# EAGLE design pH (EAGLE 9.6.2)
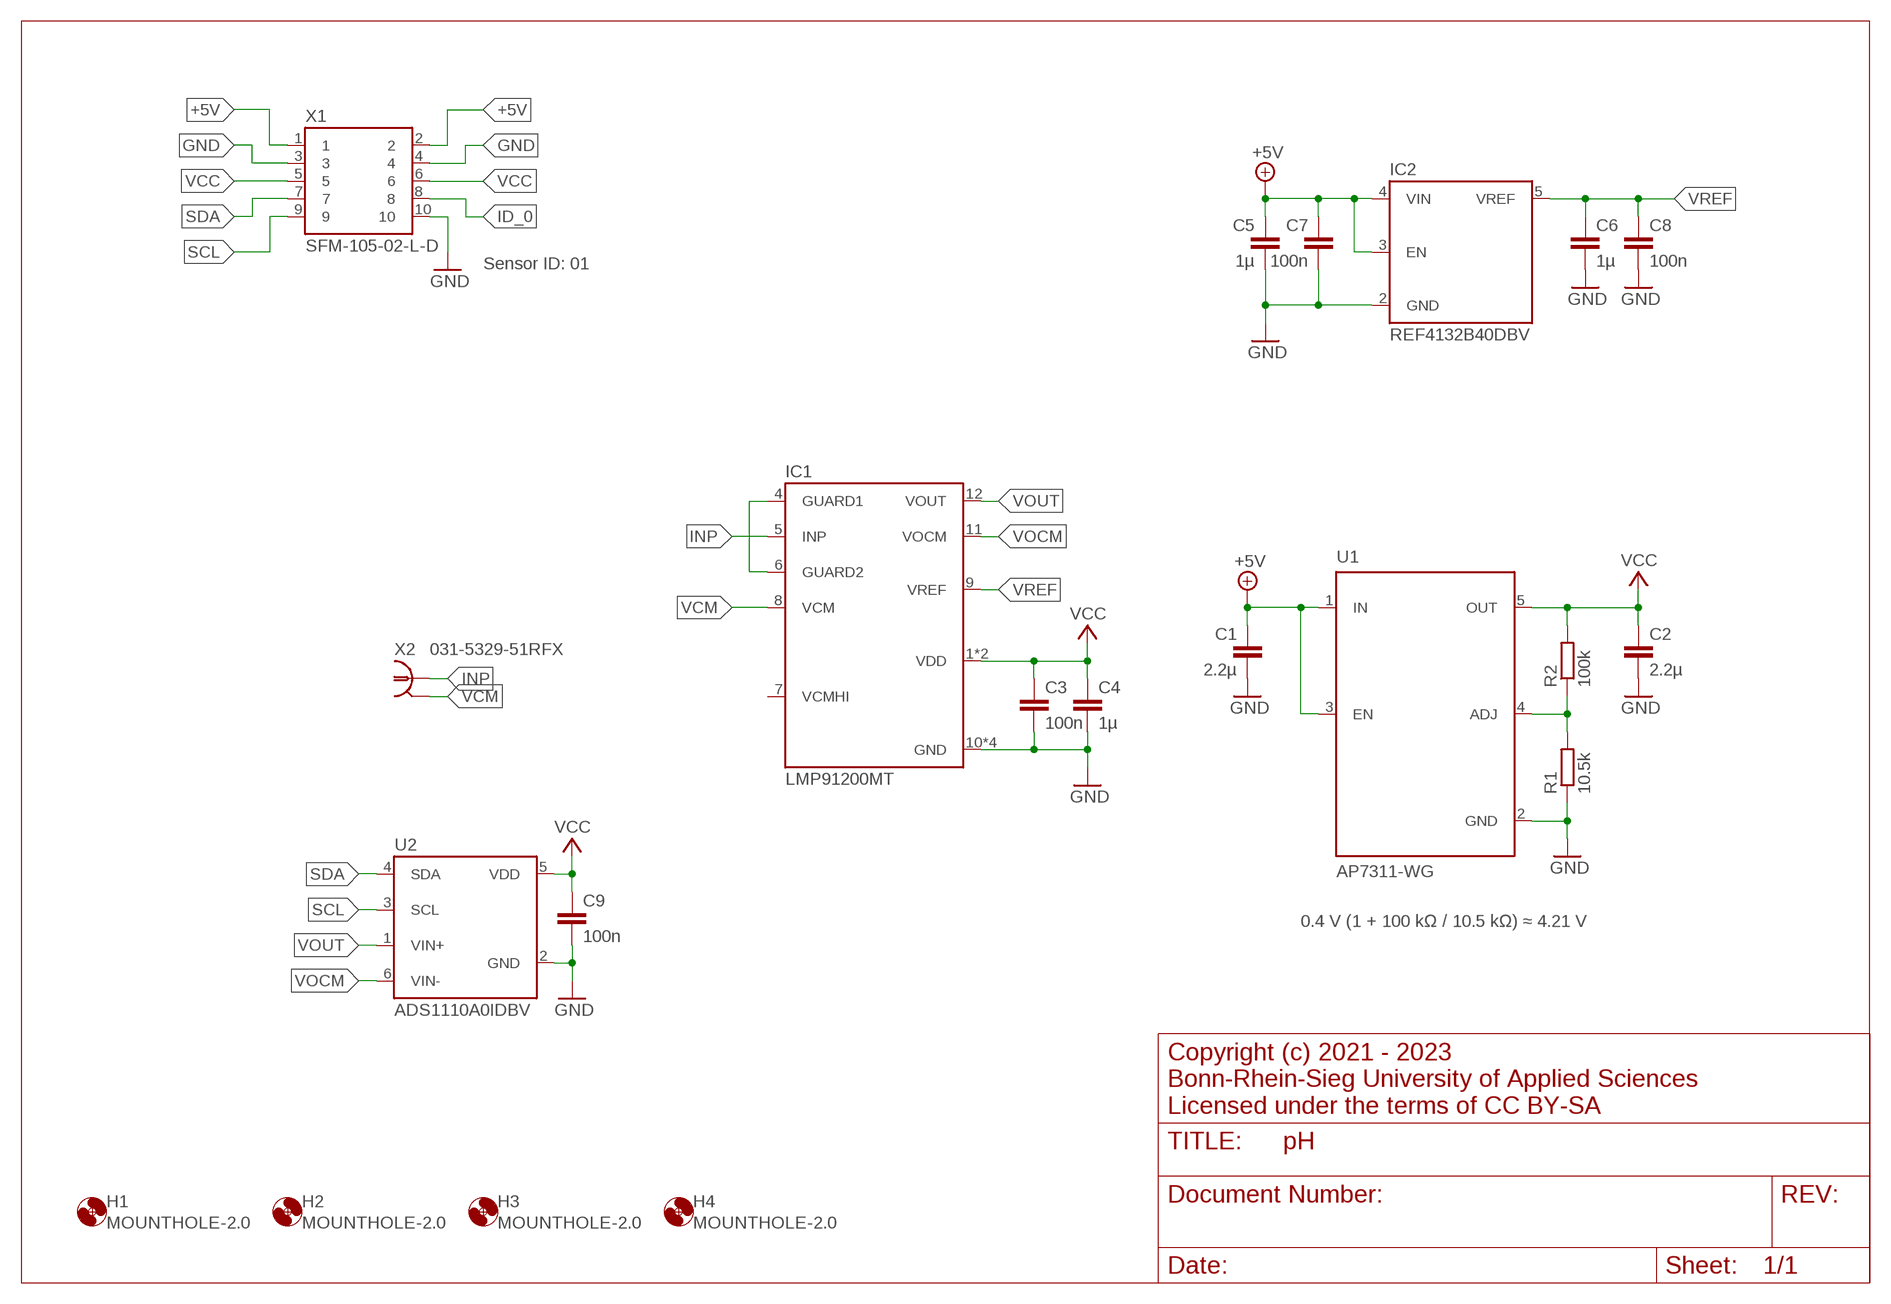
[diagram p0: schematic, sheet 1]

## Parts
C1  2.2µ  C-EUC0603  [C0603]
C2  2.2µ  C-EUC0603  [C0603]
C3  100n  C-EUC0603  [C0603]
C4  1µ  C-EUC0603  [C0603]
C5  1µ  C-EUC0603  [C0603]
C6  1µ  C-EUC0603  [C0603]
C7  100n  C-EUC0603  [C0603]
C8  100n  C-EUC0603  [C0603]
C9  100n  C-EUC0603  [C0603]
H1  MOUNTHOLE-2.0  [2.0]
H2  MOUNTHOLE-2.0  [2.0]
H3  MOUNTHOLE-2.0  [2.0]
H4  MOUNTHOLE-2.0  [2.0]
IC1  LMP91200MT  [TSSOP16]
IC2  REF4132B40DBV  [SOT23-5]
R1  10.5k  R-EU_R0603  [R0603]
R2  100k  R-EU_R0603  [R0603]
U1  AP7311-WG  [SOT-23]
U2  ADS1110A0IDBV  [SOT23-6]
X1  SFM-105-02-L-D  [SAMTEC-SFM-105-02-L-D]
X2  031-5329-51RFX  [031-5329-51RFX]

## Nets
+5V: C1.1 C5.1 C7.1 IC2.3(EN) IC2.4(VIN) U1.1(IN) U1.3(EN) X1.1 X1.2
GND: C1.2 C2.2 C3.2 C4.2 C5.2 C6.2 C7.2 C8.2 C9.2 IC1.10(GND) IC1.13(GND) IC1.15(GND) IC1.16(GND) IC2.2(GND) R1.1 U1.2(GND) U2.2(GND) X1.3 X1.4 X1.10
ID_0: X1.8
INP: IC1.5(INP) X2.1
N$1: IC1.4(GUARD1) IC1.6(GUARD2)
N$2: R1.2 R2.1 U1.4(ADJ)
SCL: U2.3(SCL) X1.9
SDA: U2.4(SDA) X1.7
VCC: C2.1 C3.1 C4.1 C9.1 IC1.1(VDD) IC1.14(VDD) R2.2 U1.5(OUT) U2.5(VDD) X1.5 X1.6
VCM: IC1.8(VCM) X2.2 X2.3 X2.4 X2.5
VOCM: IC1.11(VOCM) U2.6(VIN-)
VOUT: IC1.12(VOUT) U2.1(VIN+)
VREF: C6.1 C8.1 IC1.9(VREF) IC2.5(VREF)
Unconnected: IC1.7(VCMHI)

## Notes on the sheet
- Sensor ID: 01
- 0.4 V (1 + 100 kΩ / 10.5 kΩ) ≈ 4.21 V
- Copyright (c) 2021 - 2023
  Bonn-Rhein-Sieg University of Applied Sciences
  Licensed under the terms of CC BY-SA

## Library data of the parts
C1-C9 = rcl:C-EU: CAPACITOR, European symbol
H1-H4 = MountHoles:MOUNTHOLE-2.0
IC1 = LMP91200:LMP91200: Configurable AFE for Low-Power Chemical-Sensing Applications
IC2 = REF4132:REF4132: Low-Drift, Low-Power, Small-Footprint Series Voltage Reference
R1 R2 = rcl:R-EU_: RESISTOR, European symbol
U1 = AP7311:AP7311-?*: 150mA, Low Quiescent Current, Fast Transient, Low Dropout Linear Regulator
U2 = ADS1110:ADS1110*I?: 16-Bit ANALOG-TO-DIGITAL CONVERTER with Onboard Reference
X1 = SFM-10x-02-L-D:SFM-105-02-L-D
X2 = BNC:031-5329-51RFX: BNC CONNECTOR

## Board
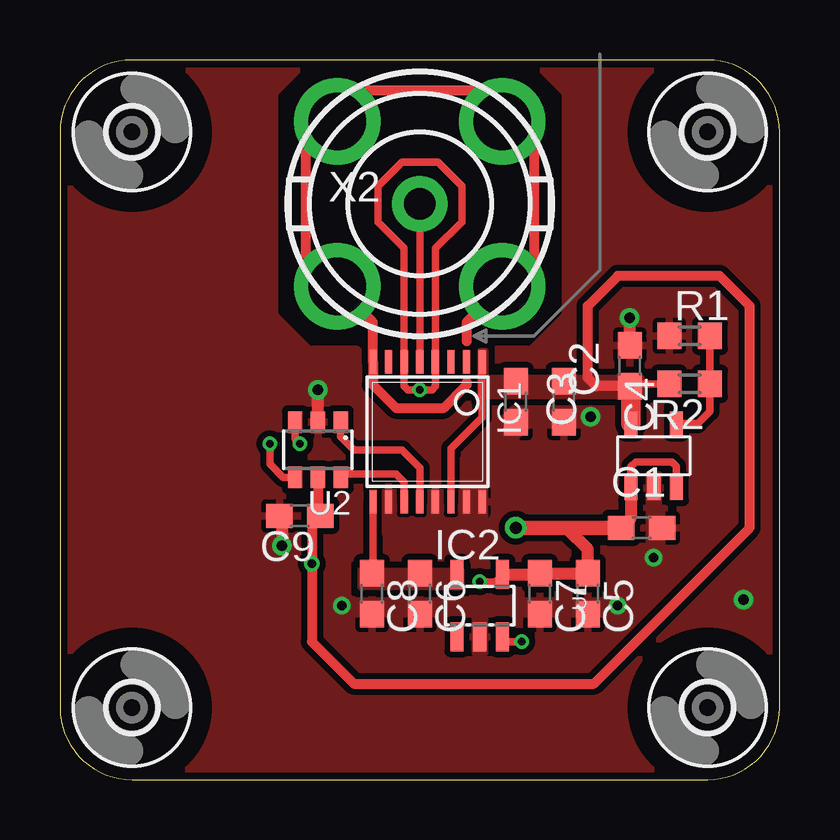
[diagram p1: board, top side]
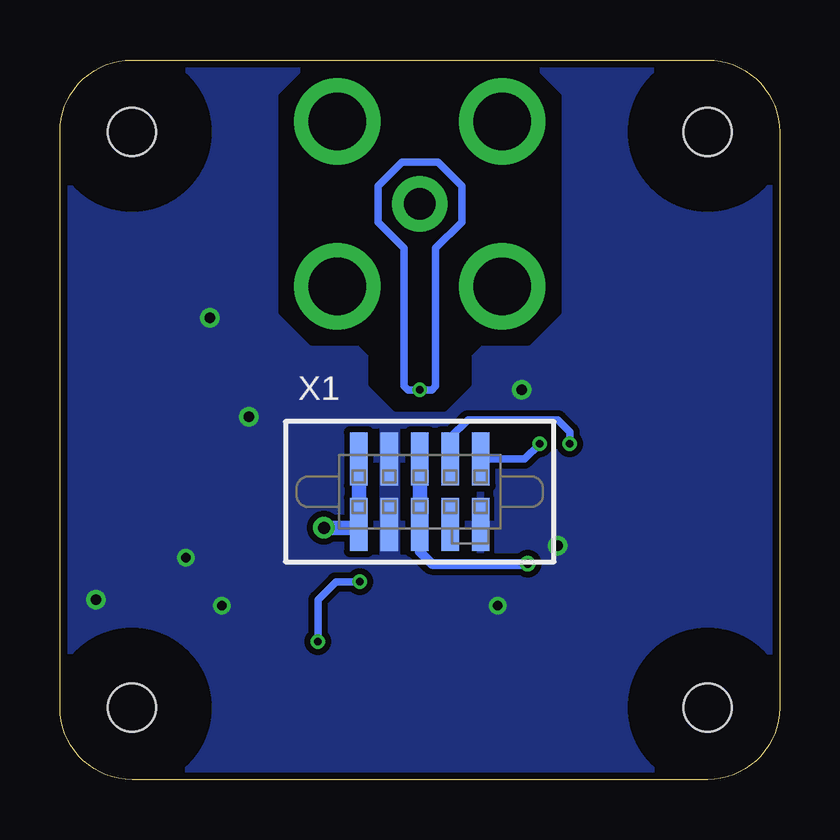
[diagram p2: board, bottom side, seen from below]

Size 30 x 30 mm. Coordinates in mm from the lower left corner, seen from the top.
Outline: 3,0 27,0 arc90 30,3 30,27 arc90 27,30 3,30 arc90 0,27 0,3 arc90 3,0
Copper layers (1*16): Top 0.035mm / dielectric 1.5mm / Bottom 0.035mm
Design rules "PCB-POOL Standard": minimum track width 0.15mm, minimum drill 0.3mm, track to track 0.15mm, track to pad 0.15mm, pad to pad 0.15mm, via to via 0.15mm, smd to smd 0.15mm, copper to edge 0.3mm, drill to drill 0.2mm, minimum pad ring 0.2mm, minimum via ring 0.15mm, stop-mask expansion 0.075mm, vias tented up to drill 0mil, thermal gap 0.2mm

### Footprints (pad centres in the part's own frame; a part is rotated, then mirrored left to right if it is on the bottom)
C0603 = smd 1.1 x 1: 1 -0.85,0; 2 0.85,0
2.0 = hole 2: 0,0
TSSOP16 = smd 0.305 x 0.991: 1 -2.275,-2.918; 2 -1.625,-2.918; 3 -0.975,-2.918; 4 -0.325,-2.918; 5 0.325,-2.918; 6 0.975,-2.918; 7 1.625,-2.918; 8 2.275,-2.918; 9 2.275,2.918; 10 1.625,2.918; 11 0.975,2.918; 12 0.325,2.918; 13 -0.325,2.918; 14 -0.975,2.918; 15 -1.625,2.918; 16 -2.275,2.918
SOT23-5 = smd 0.55 x 1.2: 1 -0.95,-1.3; 2 0,-1.3; 3 0.95,-1.3; 4 0.95,1.3; 5 -0.95,1.3
R0603 = smd 1 x 1.1: 1 -0.85,0; 2 0.85,0
SOT-23 = smd 0.55 x 1: 1 -0.95,-1.35; 2 0,-1.35; 3 0.95,-1.35; 4 0.95,1.35; 5 -0.95,1.35
SOT23-6 = smd 0.6 x 0.9: 1 -0.95,-1.15; 2 0,-1.15; 3 0.95,-1.15; 4 0.95,1.15; 5 0,1.15; 6 -0.95,1.15
SAMTEC-SFM-105-02-L-D = smd 0.74 x 2.22: 1 -2.54,1.365; 2 -2.54,-1.365; 3 -1.27,1.365; 4 -1.27,-1.365; 5 0,1.365; 6 0,-1.365; 7 1.27,1.365; 8 1.27,-1.365; 9 2.54,1.365; 10 2.54,-1.365
031-5329-51RFX = drill 1.3 pad 2.3: 1 0,0 | drill 2.4 pad 3.6: 2 3.44,3.44; 3 -3.44,3.44; 4 -3.44,-3.44; 5 3.44,-3.44

### Placement (x,y rotation side)
C1  24.25,10.5 0 top
C2  23.75,17.25 90 top
C3  19,15.75 270 top
C4  21,15.75 270 top
C5  22,7.75 270 top
C6  15,7.75 270 top
C7  20,7.75 270 top
C8  13,7.75 270 top
C9  10,11 180 top
H1  3,3 0 top
H2  27,3 0 top
H3  27,27 0 top
H4  3,27 0 top
IC1  15.32,14.5 180 top
IC2  17.5,7.25 0 top
R1  26.25,18.5 0 top
R2  26.25,16.5 180 top
U1  24.75,13.5 0 top
U2  10.75,13.75 180 top
X1  15,12 0 bottom
X2  15,24 0 top

### Tracks (layer width: path | path; a pad name or v marks a point on that pad's centre or on a via)
+5V  (via drill 0.3, 0.5)
  Top 0.305: U1.3 25.7,13.05 25.5,13.25 24,13.25 23.8,13.05 U1.1 | IC2.3 18.65,5.75 v19.25,5.75 | IC2.4 18.15,8.25 v17.5,8.25
  Top 0.508: IC2.4 19.95,8.55 C7.1 C5.1 22,9.6 21.1,10.5 | U1.1 23.8,10.9 C1.1
  Top 0.61: 21.1,10.5 v19,10.5 C1.1
  Bottom 0.305: v17.5,8.25 18.5,8.25 19.25,7.5 v19.25,5.75
  Bottom 0.61: X1.1 X1.2 17.68,10.5 v19,10.5
GND  (via drill 0.4, 0.45)
  Top 0.406: C9.2 9.25,10.9
  Top 0.508: 9.25,10.9 v9.25,9.75 | C2.2 v23.75,19.25 | U2.2 v10.75,16.25
  other vias: 22.12,15.12 11.75,7.25 23.25,7.25 24.75,9.25 28.5,7.5
  cutout Top: 16,15.5 14,15.5 13,16.5 13,17.75 12.5,18.25 10.5,18.25 9.25,19.5 9.25,28.5 10.5,29.75 19.5,29.75 20.75,28.5 20.75,19.5 19.5,18.25 17.5,18.25 17,17.75 17,16.5
  pour Bottom (isolate 0.254, rank 2): 3,0 27,0 arc90 30,3 30,27 arc90 27,30 3,30 arc90 0,27 0,3 arc90
  pour Bottom (no thermals): 15.9,14.6 16.6,14.6 16.6,9.4 15.9,9.4
  pour Top (no thermals): 13.5,12 13.5,10.25 17.75,10.25 17.75,13 19.5,14.75 22.62,14.75 22.62,15.5 18.88,15.5 16.75,13.38 16.75,12
  pour Top (no thermals): 17.75,5.25 17.75,7 23.5,7 23.5,7.5 11.5,7.5 11.5,7 17.25,7 17.25,5.25
  pour Top (no thermals): 24.5,12.75 24.5,9 25,9 25,12.75
  pour Top (isolate 0.254, rank 2): 3,0 27,0 arc90 30,3 30,27 arc90 27,30 3,30 arc90 0,27 0,3 arc90
GUARD
  cutout Bottom: 14,15.5 16,15.5 17,16.5 17,17.75 17.5,18.25 19.5,18.25 20.75,19.5 20.75,28.5 19.5,29.75 10.5,29.75 9.25,28.5 9.25,19.5 10.5,18.25 12.5,18.25 13,17.75 13,16.5
INP
  Top 0.305: IC1.5 X2.1
N$1  (via drill 0.3)
  Top 0.305: IC1.4 15.65,22.15 16.75,23.25 16.75,24.75 15.75,25.75 14.25,25.75 13.25,24.75 13.25,23.25 14.35,22.15 IC1.6 14.35,16.4 14.5,16.25 v15,16.25 15.5,16.25 15.65,16.4 IC1.4
  Bottom 0.305: v15,16.25 14.5,16.25 14.35,16.4 14.35,22.15 13.25,23.25 13.25,24.75 14.25,25.75 15.75,25.75 16.75,24.75 16.75,23.25 15.65,22.15 15.65,16.4 15.5,16.25 v15,16.25
N$2
  Top 0.305: U1.4 26.6,14.85 27.1,15.35 R2.1 R1.2
SCL  (via drill 0.3)
  Top 0.305: U2.3 9.8,14.2 v10,14
  Bottom 0.305: v10,14 10.63,13.37 X1.9
SDA  (via drill 0.3)
  Top 0.305: U2.4 9.3,12.6 8.75,13.15 v8.75,14
  Bottom 0.305: v8.75,14 8.75,14.5 9.25,15 13,15 13.73,14.27 X1.7
VCC  (via drill 0.35)
  Top 0.305: R2.2 23.95,16.5 23.8,16.35 | IC1.1 17.6,15.1 16.3,13.8 IC1.14
  Top 0.406: U2.5 10.75,11.1 C9.1 10.5,10.65 v10.5,9 10.5,5.75 12.25,4 22.25,4 28.75,10.5 28.75,19.75 27.5,21 23.25,21 22,19.75 22,16.75 22.35,16.4 C2.1
  Top 0.508: 23.8,16.35 C2.1
  Top 0.813: U1.5 23.8,16.35
  Bottom 0.406: v10.5,9 14.5,9 15,9.5 X1.6
  Bottom 0.61: X1.5 X1.6
  pour Top (no thermals): 24.25,16.75 17.75,16.75 17.75,17.88 17.5,17.88 17.5,16 24.25,16
VCM
  Top 0.406: 16.95,16.57 16.95,16.45 16,15.5 14,15.5 13.05,16.45 IC1.8 13.05,19.07 X2.4 10.25,21.87 10.25,26.13 X2.3 12.87,28.75 17.13,28.75 X2.2 19.75,26.13 19.75,21.87 X2.5 16.95,19.07 16.95,18.27
VOCM
  Top 0.305: U2.6 11.85,12.75 14,12.75 14.35,12.4 IC1.11
VOUT
  Top 0.305: IC1.12 15,13 14.25,13.75 12.25,13.75 11.7,14.3 U2.1
VREF
  Top 0.305: IC1.9 13.05,8.65 C8.1
  pour Top (no thermals): 16.75,8 12.5,8 12.5,8.75 16.75,8.75

### Text on the board
tStop: pH / ORP | 2.1
tDocu: Trace intentionally left open!